# Altium project Longboard_32bit_ext.PrjPCB (part 3 of 6)

## Sheet DC_Power_Regulation.SchDoc: STM32F412 CNC
size B; Author: AM; CompanyName: Expatria Technologies; DrawnBy: A.Marles; Engineer: AM; Organization: Expatria Technolgoies; Address1: PO Box 2084; Address3: Merritt, BC V1K 1B8; Address4: Canada; DocumentNumber: 19; Revision: B9; SheetNumber: 19; SheetTotal: 27
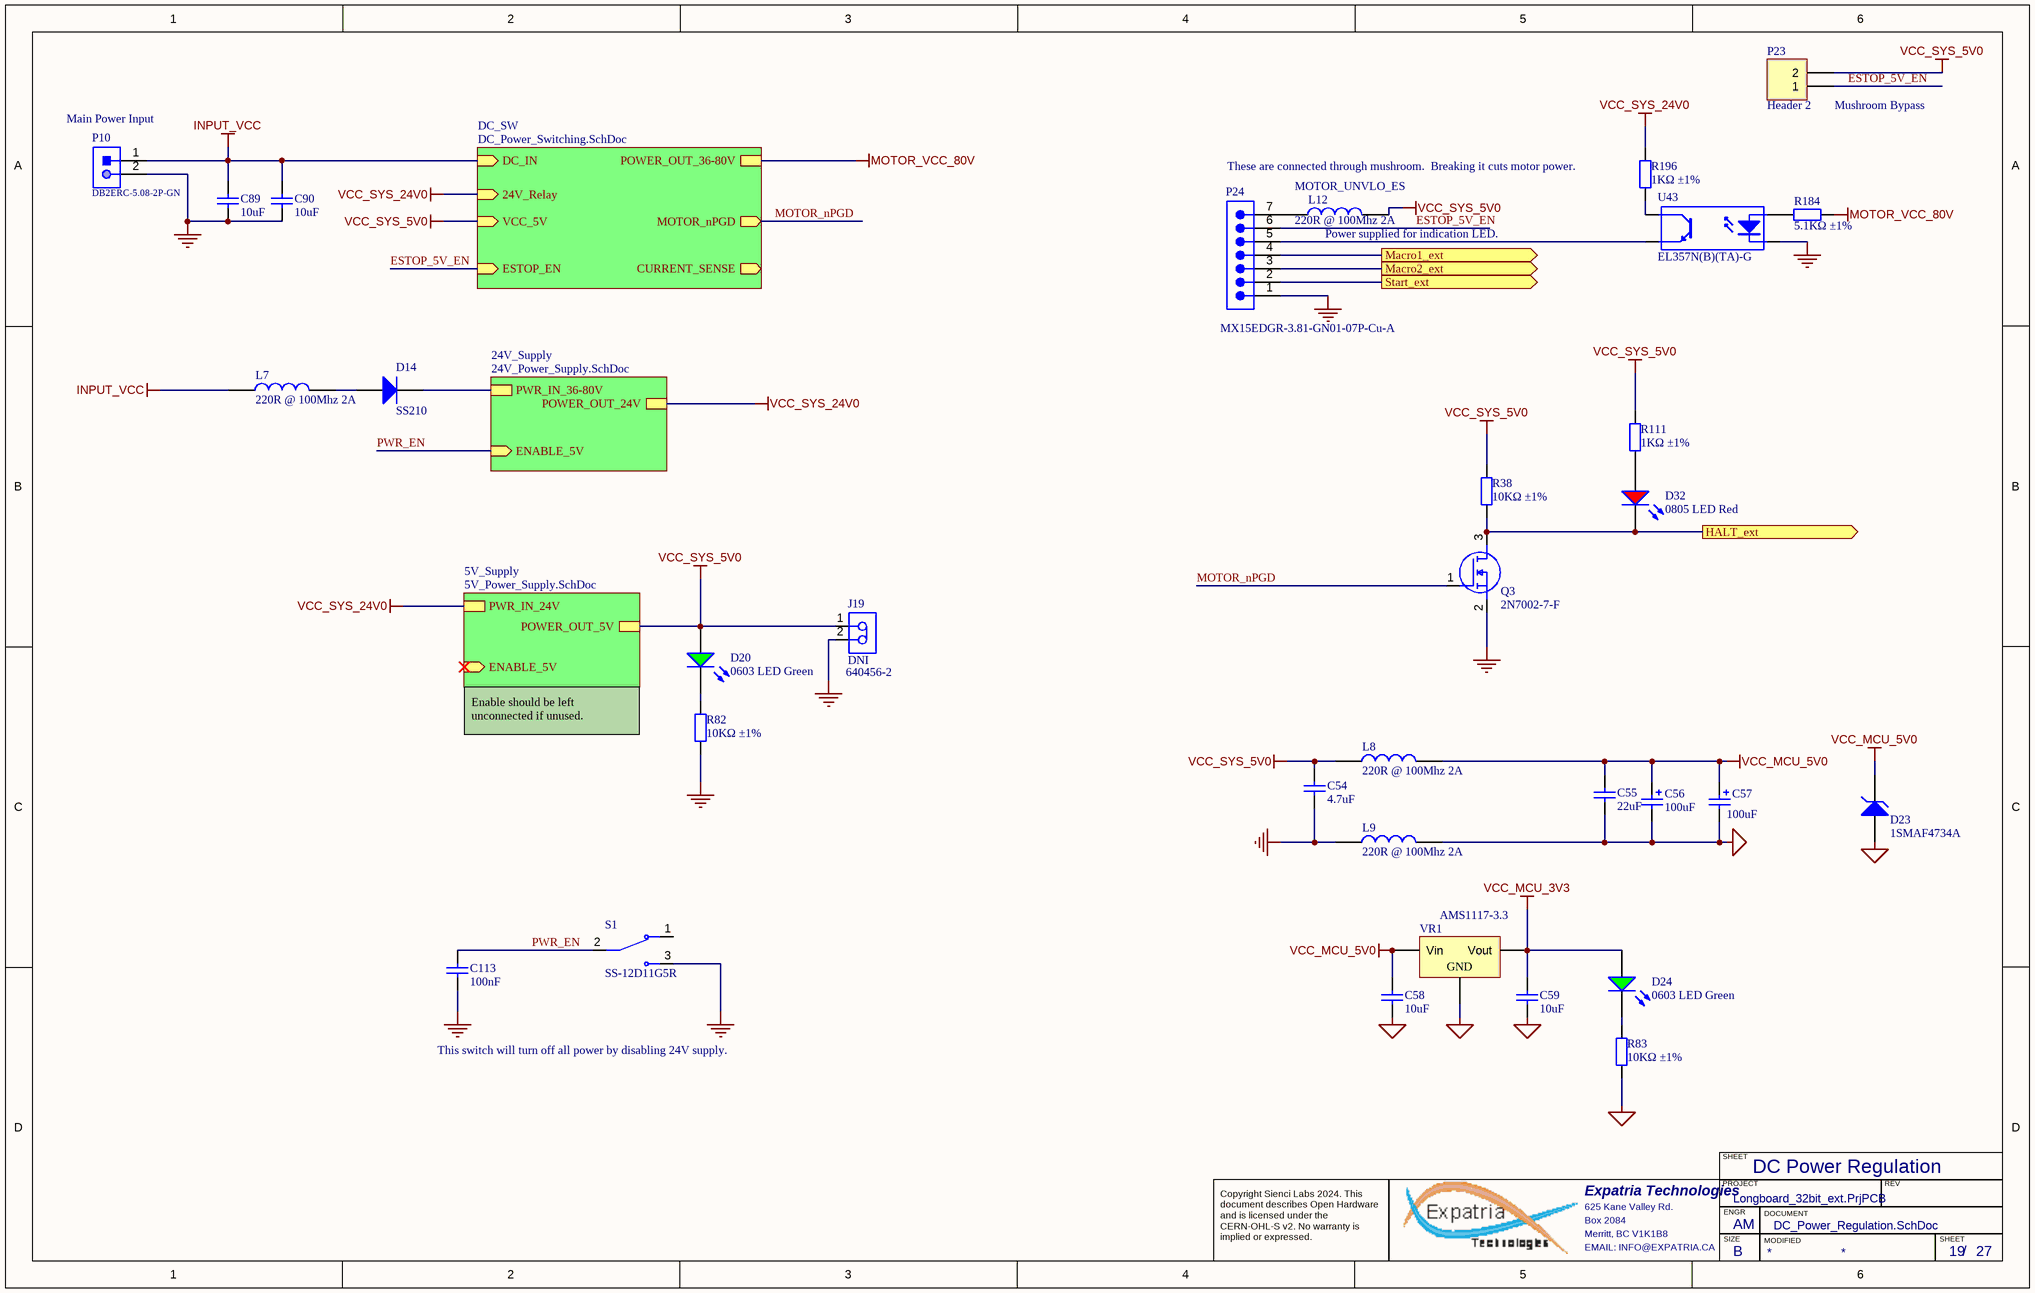
[diagram p12: DC_Power_Regulation.SchDoc]

### Parts
C54  4.7uF  [0603_C]
C55  22uF  [0805_C]
C56  100uF  [CASE-B_3528]
C57  100uF  [WCAP-ASLI_D6.3H7.7]
C58  10uF  [1206_C]
C59  10uF  [1206_C]
C89  10uF  [1206_C]
C90  10uF  [1206_C]
C113  100nF  [0603_C]
D14  SS210  [SMA(DO-214AC)_S1]
D20  0603 LED Green  [0603_LED_S1 - GREEN]
D23  1SMAF4734A  [DIOM5226X240N]
D24  0603 LED Green  [0603_LED_S1 - GREEN]
D32  0805 LED Red  [0805_LED_S1 - RED]
J19  DNI  value 640456-2  [TECO-640456-2_V]
L7  220R @ 100Mhz 2A  [0805_R]
L8  220R @ 100Mhz 2A  [0805_R]
L9  220R @ 100Mhz 2A  [0805_R]
L12  220R @ 100Mhz 2A  [0805_R]
P10  DB2ERC-5.08-2P-GN  [CONN-TH_2P-P5.08_DB2ERC-5.08-2P]
P23  Header 2  [HDR1X2]
P24  MX15EDGR-3.81-GN01-07P-Cu-A  [691322310007]
Q3  2N7002-7-F  [SOT-23(SOT-23-3)]
R38  10KΩ ±1%  [0603_R]
R82  10KΩ ±1%  [0603_R]
R83  10KΩ ±1%  [0603_R]
R111  1KΩ ±1%  [0603_R]
R184  5.1KΩ ±1%  [0603_R]
R196  1KΩ ±1%  [0603_R]
S1  SS-12D11G5R  [SW_500SSP1S1M6QEA]
U43  EL357N(B)(TA)-G  [SOP-4_P2.54]
VR1  AMS1117-3.3  [SOT-223]

### Sub-sheets
5V_Supply = 5V_Power_Supply.SchDoc: POWER_OUT_5V, PWR_IN_24V, ENABLE_5V (in)
24V_Supply = 24V_Power_Supply.SchDoc: ENABLE_5V (in), POWER_OUT_24V, PWR_IN_36-80V
DC_SW = DC_Power_Switching.SchDoc: POWER_OUT_36-80V, DC_IN (in), 24V_Relay (in), VCC_5V (in), MOTOR_nPGD (out), ESTOP_EN (in), CURRENT_SENSE (out)

### Ports
HALT_ext (out), Macro1_ext (out), Macro2_ext (out), Start_ext (out)

### Nets
GND: C54.1 C89.1 C90.1 C113.1 J19.2 L9.1 P10.2 P24.1 Q3.2(S) R82.1 S1.3(NO) U43.2(K)
INPUT_VCC: C89.2 C90.2 L7.1 P10.1 ; sheet DC_SW/DC_IN
MCU_GND: C55.1 C56.2 C57.2(N) C58.1 C59.1 D23.1(A) L9.2 R83.1 VR1.1(GND)
MOTOR_VCC_80V: R184.2 ; sheet DC_SW/POWER_OUT_36-80V
VCC_MCU_3V3: C59.2 D24.A VR1.2(Vout)
VCC_MCU_5V0: C55.2 C56.1 C57.1(P) C58.2 D23.2(K) L8.2 VR1.3(Vin)
VCC_SYS_5V0: C54.2 D20.A J19.1 L8.1 L12.2 P23.2 R38.2 R111.2 ; sheet 5V_Supply/POWER_OUT_5V, sheet DC_SW/VCC_5V
VCC_SYS_24V0: R196.2 ; sheet 5V_Supply/PWR_IN_24V, sheet 24V_Supply/POWER_OUT_24V, sheet DC_SW/24V_Relay
ESTOP_5V_EN: P23.1 P24.6 ; sheet DC_SW/ESTOP_EN
HALT_ext: D32.K Q3.3(D) R38.1 ; port HALT_ext
Macro1_ext: P24.4 ; port Macro1_ext
Macro2_ext: P24.3 ; port Macro2_ext
MOTOR_nPGD: Q3.1(G) ; sheet DC_SW/MOTOR_nPGD
PWR_EN: C113.2 S1.2(COM) ; sheet 24V_Supply/ENABLE_5V
PWR_IN_36-80V: D14.2(K) ; sheet 24V_Supply/PWR_IN_36-80V
Start_ext: P24.2 ; port Start_ext
NetD14_1: D14.1(A) L7.2
NetD20_K: D20.K R82.2
NetD24_K: D24.K R83.2
NetD32_A: D32.A R111.1
NetL12_1: L12.1 P24.7
NetP24_5: P24.5 U43.3(E)
NetR184_1: R184.1 U43.1(A)
NetR196_1: R196.1 U43.4(C)

Not connected (* = marked no-connect by the designer): S1 1(NC)

### Notes on the sheet
- (near P10) Main Power Input
- (near P23) Mushroom Bypass
- (near R196) These are connected through mushroom.  Breaking it cuts motor power.
- (near L12) MOTOR_UNVLO_ES
- (near L12) Power supplied for indication LED.
- Enable should be left unconnected if unused.
- This switch will turn off all power by disabling 24V supply.
- DC Power Regulation
- SHEET
- Expatria Technologies
- 625 Kane Valley Rd.
- Box 2084
- Merritt, BC V1K1B8
- PROJECT
- SIZE
- ENGR
- MODIFIED
- DOCUMENT
- REV
- Copyright Sienci Labs 2024. This document describes Open Hardware and is licensed under the CERN-OHL-S v2. No warranty is implied or expressed.
- EMAIL: INFO@EXPATRIA.CA
- B
- /

### Library data of the parts
C54 = 0603 4.7uF (475) 10% 16V: 16V 4.7uF X5R ±10% 0603 Multilayer Ceramic Capacitors MLCC - SMD/SMT ROHS; Manufacturer: Samsung Electro-Mechanics; Manufacturer Part Number: CL10A475KO8NNNC; ComponentLink1Description: Supplier link; ComponentLink1URL: http://www.szlcsc.com/product/details_20375.html; Package: 0603; Supplier: LC; SuppliersPartNumber: C19666; Capacitance: 4.7uF; Tolerance: 10%; Voltage: 16V
C55 = 0805 22uF (226) 20% 25V: 25V 22uF X5R ±20% 0805 Multilayer Ceramic Capacitors MLCC - SMD/SMT ROHS; Manufacturer: Samsung Electro-Mechanics; Manufacturer Part Number: CL21A226MAQNNNE; ComponentLink1Description: Supplier link; ComponentLink1URL: http://www.szlcsc.com/product/details_46786.html; Package: 0805; Supplier: LC; SuppliersPartNumber: C45783; Capacitance: 22uF; Tolerance: 20%; Voltage: 25V
C56 = 3528 100uF (107) 10% 6.3V: Tantalum capacitor; Manufacturer: AVX; Manufacturer Part Number: TAJB107K006RNJ; Tolerance: 10%; Voltage: 6.3V; ComponentLink1Description: Supplier link; ComponentLink1URL: http://www.szlcsc.com/product/details_16815.html; Package: 3528; Supplier: LCSC; SuppliersPartNumber: C16133; Capacitance: 100uF
C57 = 865080445010: -45℃~+105℃ 2000hrs@105℃ 100uF 7.7mm 35V 6.3mm ±20% SMD,6.3x7.7mm Aluminum Electrolytic Capacitors - SMD ROHS; Manufacturer: Capxon International Elec; Manufacturer Part Number: HV101M035E077ETR; SuppliersPartNumber: C59934; Value: 100uF; Supplier: LCSC
C58 C59 C89 C90 = 1206 10uF (106) 10% 50V: 50V 10uF X5R ±10% 1206 Multilayer Ceramic Capacitors MLCC - SMD/SMT ROHS; Manufacturer: Samsung Electro-Mechanics; Manufacturer Part Number: CL31A106KBHNNNE; Package: 1206; Supplier: LC; SuppliersPartNumber: C13585; Capacitance: 10uF; Tolerance: 10%; Voltage: 50V
C113 = 0603 100nF (104) 10% 50V: 50V 100nF X7R ±10% 0603 Multilayer Ceramic Capacitors MLCC - SMD/SMT ROHS; Manufacturer: YAGEO; Manufacturer Part Number: CC0603KRX7R9BB104; ComponentLink1Description: Supplier link; ComponentLink1URL: http://www.szlcsc.com/product/details_15331.html; Package: 0603; Supplier: LC; SuppliersPartNumber: C14663; Capacitance: 100nF; Tolerance: 10%; Voltage: 50V
D14 = SMA(DO-214AC) SS210: 100V 2A 850mV @ 2A SMA(DO-214AC) Schottky Barrier Diodes (SBD) ROHS; Manufacturer: MDD(Microdiode Electronics); ComponentLink1Description: 供应商链接; ComponentLink1URL: http://www.szlcsc.com/product/details_15669.html; Package: SMA(DO-214AC); Supplier: LC; SuppliersPartNumber: C14996; Manufacturer Part Number: SS210
D20 D24 = MHT192UGCT: 20mA -40℃~+85℃ 515nm~530nm Emerald 120° 60mW 0603 Light Emitting Diodes (LED) ROHS; Manufacturer: MEIHUA; Package: 0603; Supplier: LC; SuppliersPartNumber: C389519; Color: Green; Manufacturer Part Number: MHT192UGCT
D23 = BZT52C27: 27V ±5% 1W 500nA @ 20.5V SMA(DO-214AC) Zener Diodes RoHS; Manufacturer: Shandong Jingdao Microelectronics; ComponentLink1Description: 供应商链接; ComponentLink1URL: http://www.szlcsc.com/product/details_8541.html; Package: SMAF; Supplier: LCSC; SuppliersPartNumber: C169539; Manufacturer Part Number: 1SMAF4734A
D32 = 0805 LED Red: Red 0805 Light Emitting Diodes (LED) ROHS; Manufacturer: Foshan NationStar Optoelectronics; Manufacturer Part Number: NCD0805R1; Package: 0805; Supplier: LC; SuppliersPartNumber: C84256; Color: Red
J19 = CMP-2000-05417-1: Male Header, Pitch 2.54 mm, 1 x 2 Position, Height 10.49 mm, Tail Length 3.556 mm, -55 to 105 degC, RoHS, Bulk; Manufacturer: TE Connectivity; Standards: RoHSCompliant,ELVCompliant,UL94V-0; Material, Housing: Polyester; Agency Approvals: CSA,UL; Brand/Series: MTA-100Series; Contact Centerline Spacing: 0.100 / in.; Material, Contact: CopperAlloy; Current, Rating: 5 / A; Color, Housing: White; Contact Termination Area Plating: Tin; Special Features: Pinstrip; Number of Positions: 2; Pin Spacing: 0.1 / "; Temperature, Operating: -55to+105 / degC; Angle: Straight; Mount Angle: Vertical; Connector Type: MTA-100; Primary Type: InterconnectSystem; Voltage, Rating: 250 / V; Mounting Hole Size: 0.04 / "; Number of Rows: 1; Termination: Solder; Length, Terminal Post: 0.14 / in.; Manufacturer URL: http://www.te.com/; Color: White; Size, Post: 0.025 / in.; Contact Shape: Square; Mounting Type: PCMount; Datasheet URL: https://datasheet.ciiva.com/11746/0900766b80eb7fdd-11746365.pdf; Type: PCBPlug; Datasheet Version: Rev. W, 06/2004; Number of Contacts: 2; Flammability Rating: UL94V-0; Contact Plating: Tin; Length, Pin: 0.14 / "; Contact Mating Area Plating: Tin; Length, Overall: 0.2 / "; SuppliersPartNumber: C86502
L7-L9 L12 = CBW201209U221T: 150mΩ ±25% 220Ω@100MHz 0805 Ferrite Beads ROHS; Manufacturer: FH (Guangdong Fenghua Advanced Tech); Manufacturer Part Number: CBW201209U221T; Package: 0402; Supplier: LC; SuppliersPartNumber: C139188
P10 = DB2ERC-5.08-2P-GN: 320V 20A 2 Bend -40℃~+105℃ 1 5.08mm 1x2P Green Board Edge/Receptacle-Close Push-Pull,P=5.08mm Pluggable System Terminal Block ROHS; Manufacturer: Dibo; Supplier 1: LCSC; Supplier Part Number 1: C395737; Manufacturer Part Number: DB2ERC-5.08-2P-GN; RoHS: Yes; Category: Terminals; SuppliersPartNumber: C395737
P23 = Header 2: Straight Square Pins 2 2.54mm Black Brass 1x2P Plugin,P=2.54mm Pin Headers ROHS; Manufacturer: MOLEX; Manufacturer Part Number: 22284020; Publisher: Altium Limited; LatestRevisionDate: 17-Jul-2002; LatestRevisionNote: Re-released for DXP Platform.; SuppliersPartNumber: C234182; Supplier 1: LCSC; Supplier Part Number 1: C234182
P24 = MX15EDGR-3.81-GN01-07P-Cu-A: 300V 8A 7 Bend -40℃~+105℃ 1 3.81mm 1x7P Green Board Edge/Receptacle-Close Push-Pull,P=3.81mm Pluggable System Terminal Block ROHS; Manufacturer: MAX; Manufacturer Part Number: MX15EDGR-3.81-GN01-07P-Cu-A; SuppliersPartNumber: C5188162
Q3 = 2N7002-7-F: 60V 115mA 7.5Ω@5V,50mA 370mW N Channel SOT-23 MOSFETs ROHS; Manufacturer: Diodes Inc.; SuppliersPartNumber: C85049; Manufacturer Part Number: 2N7002-7-F; Value: 2N7002-7-F; Datasheet Link: https://datasheet.datasheetarchive.com/originals/distributors/SFDatasheet-0/sf-0003625.pdf; Height: 1.2mm; Manufacturer_Part_Number: 2N7002-7-F; Mouser Part Number: 621-2N7002-F; Mouser Price/Stock: https://www.mouser.co.uk/ProductDetail/Diodes-Incorporated/2N7002-7-F?qs=jMXWnm70%252BC%252BAX%252BMLzUkTZg%3D%3D; Arrow Part Number: 2N7002-7-F; Arrow Price/Stock: https://www.arrow.com/en/products/2n7002-7-f/diodes-incorporated?region=nac
R38 R82 R83 = 0603 10K (1002) 1%: Chip resistor; Manufacturer: Uniroyal Elec; Manufacturer Part Number: 0603WAF1002T5E; Power: 1/10W; ComponentLink1Description: Supplier link; ComponentLink1URL: http://www.szlcsc.com/product/details_26547.html; Package: 0603; Supplier: LC; SuppliersPartNumber: C25804; Resistance: 10KΩ; Tolerance: 1%
R111 R196 = 0603 1K (1001) 1%: Chip resistor; Manufacturer: Uniroyal Elec; Manufacturer Part Number: 0603WAF1001T5E; Power: 1/10W; ComponentLink1Description: Supplier link; ComponentLink1URL: http://www.szlcsc.com/product/details_21904.html; Package: 0603; Supplier: LC; SuppliersPartNumber: C21190; Resistance: 1KΩ; Tolerance: 1%
R184 = 0603 5.1K (5101) 1%: Chip resistor; Manufacturer: Uniroyal Elec; Manufacturer Part Number: 0603WAF5101T5E; Power: 1/10W; ComponentLink1Description: Supplier link; ComponentLink1URL: http://www.szlcsc.com/product/details_23913.html; Package: 0603; Supplier: LC; SuppliersPartNumber: C23186; Resistance: 5.1KΩ; Tolerance: 1%
S1 = SS-12D11G5R: Shrouded 5A SPDT 125V 125V 5A 10000次 Black Plugin Slide Switches ROHS; Manufacturer: XKB Connectivity; SuppliersPartNumber: C388633; Manufacturer Part Number: SS-12D11G5R
U43 = EL357N(B)(TA)-G_[C6649]: as U4-U8 on sheet Spindle_Control; Package: SOP-4_P2.54; Supplier: LC; SuppliersPartNumber: C6649; Manufacturer: Everlight; Manufacturer Part Number: EL357N(B)(TA)-G
VR1 = SOT-223 AMS1117-3.3: Vout=3.3V 1A 72dB@(120Hz) (LDO); Manufacturer 1: AMS; ComponentLink1Description: 供应商链接; ComponentLink1URL: http://www.szlcsc.com/product/details_6652.html; Package: SOT-223; Supplier: LCSC; SuppliersPartNumber: C6186; Manufacturer Part Number 1: AMS1117-3.3; Manufacturer: AMS; Manufacturer Part Number: AMS1117-3.3

## Sheet 5V_Power_Supply.SchDoc: STM32F412 CNC
size B; Author: AM; CompanyName: Expatria Technologies; DrawnBy: A.Marles; Engineer: AM; Organization: Expatria Technolgoies; Address1: PO Box 2084; Address3: Merritt, BC V1K 1B8; Address4: Canada; DocumentNumber: 21; Revision: B9; SheetNumber: 20; SheetTotal: 27
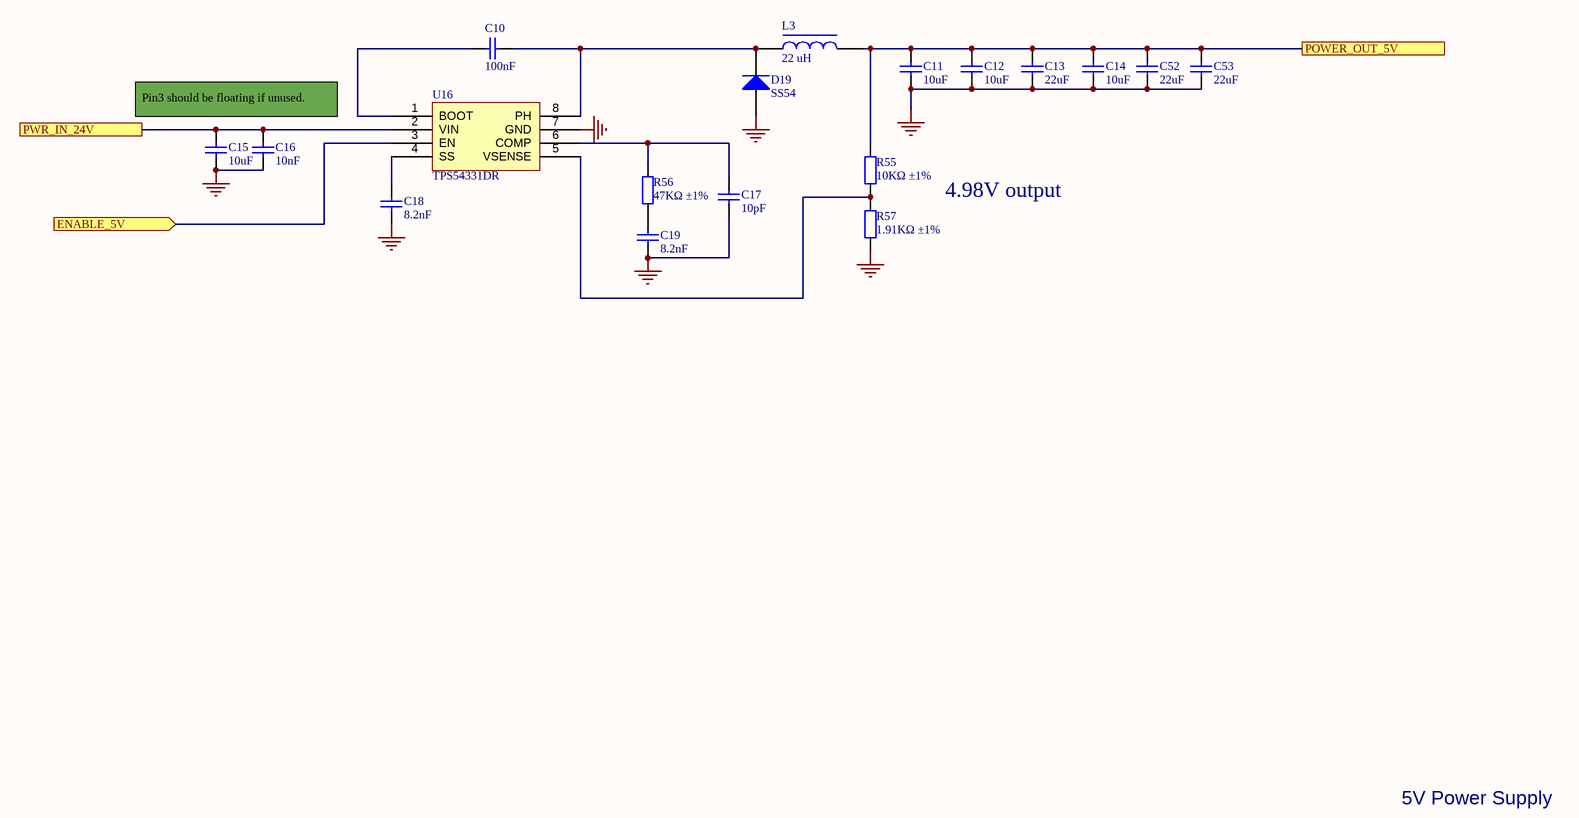
[diagram p13: 5V_Power_Supply.SchDoc]

### Parts
C10  100nF  [0603_C]
C11  10uF  [1206_C]
C12  10uF  [1206_C]
C13  22uF  [0805_C]
C14  10uF  [1206_C]
C15  10uF  [1206_C]
C16  10nF  [0603_C]
C17  10pF  [0603_C]
C18  8.2nF  [0603_C]
C19  8.2nF  [0603_C]
C52  22uF  [0805_C]
C53  22uF  [0805_C]
D19  SS54  [SMA(DO-214AC)_S1]
L3  22 uH  [INDPM7366X300N]
R55  10KΩ ±1%  [0603_R]
R56  47KΩ ±1%  [0603_R]
R57  1.91KΩ ±1%  [0603_R]
U16  TPS54331DR  [SOIC-8_150mil]

### Ports
ENABLE_5V (in), POWER_OUT_5V, PWR_IN_24V

### Nets
GND: C11.1 C12.1 C13.1 C14.1 C15.1 C16.1 C17.1 C18.1 C19.1 C52.1 C53.1 D19.1(A) R57.1 U16.7(GND)
VCC_SYS_5V0: C11.2 C12.2 C13.2 C14.2 C52.2 C53.2 L3.2 R55.2 ; port POWER_OUT_5V
VCC_SYS_24V0: C15.2 C16.2 U16.2(VIN) ; port PWR_IN_24V
ENABLE_5V: U16.3(EN) ; port ENABLE_5V
NetC10_1: C10.1 U16.1(BOOT)
NetC10_2: C10.2 D19.2(K) L3.1 U16.8(PH)
NetC17_2: C17.2 R56.2 U16.6(COMP)
NetC18_2: C18.2 U16.4(SS)
NetC19_2: C19.2 R56.1
NetR55_1: R55.1 R57.2 U16.5(VSENSE)

### Notes on the sheet
- Pin3 should be floating if unused.
- 4.98V output
- 5V Power Supply
- SHEET
- Expatria Technologies
- 625 Kane Valley Rd.
- Box 2084
- Merritt, BC V1K1B8
- PROJECT
- SIZE
- ENGR
- MODIFIED
- DOCUMENT
- REV
- Copyright Sienci Labs 2024. This document describes Open Hardware and is licensed under the CERN-OHL-S v2. No warranty is implied or expressed.
- EMAIL: INFO@EXPATRIA.CA
- B
- /

### Library data of the parts
C10 = 0603 100nF (104) 10% 50V: as C113 on sheet DC_Power_Regulation; Package: 0603; Supplier: LC; SuppliersPartNumber: C14663; Capacitance: 100nF; Tolerance: 10%; Voltage: 50V; ComponentLink1Description: Supplier link; ComponentLink1URL: http://www.szlcsc.com/product/details_15331.html
C11 C12 C14 C15 = 1206 10uF (106) 10% 50V: as C58 on sheet DC_Power_Regulation; Package: 1206; Supplier: LC; SuppliersPartNumber: C13585; Capacitance: 10uF; Tolerance: 10%; Voltage: 50V
C13 C52 C53 = 0805 22uF (226) 20% 25V: as C55 on sheet DC_Power_Regulation; Package: 0805; Supplier: LC; SuppliersPartNumber: C45783; Capacitance: 22uF; Tolerance: 20%; Voltage: 25V; ComponentLink1Description: Supplier link; ComponentLink1URL: http://www.szlcsc.com/product/details_46786.html
C16 = 0603 10nF (103) 10% 50V: 50V 10nF X7R ±10% 0603 Multilayer Ceramic Capacitors MLCC - SMD/SMT ROHS; Manufacturer: Guangdong Fenghua Advanced Tech; Manufacturer Part Number: 0603B103K500NT; Package: 0603; Supplier: LC; SuppliersPartNumber: C57112; Capacitance: 10nF; Tolerance: 10%; Voltage: 50V; ComponentLink1Description: Supplier link; ComponentLink1URL: http://www.szlcsc.com/product/details_58143.html
C17 = 0603 10pF (100) 5% 50V: Chip capacitors; Manufacturer: Samsung Electro-Mechanics; Manufacturer Part Number: CL10C100JB8NNNC; Tolerance: 5%; Voltage: 50V; Package: 0603; Supplier: LCSC; SuppliersPartNumber: C1634; Capacitance: 10pF; ComponentLink1Description: Supplier link; ComponentLink1URL: http://www.szlcsc.com/product/details_1986.html
C18 C19 = 0603 8.2nF (822) 10% 50V: 50V 8.2nF X7R ±10% 0603 Multilayer Ceramic Capacitors MLCC - SMD/SMT ROHS; Manufacturer: YAGEO; Manufacturer Part Number 1: CC0603KRX7R9BB822; Package: 0603; Supplier: LC; SuppliersPartNumber: C113812; Capacitance: 8.2nF; Tolerance: 10%; Voltage: 50V; Manufacturer 1: YAGEO; Value: 8.2nF; Manufacturer Part Number: CC0603KRX7R9BB822
D19 = SMA(DO-214AC) SS54: 40V 5A 550mV@5A; Manufacturer 1: MDD; Package: SMA(DO-214AC); Supplier: LCSC; SuppliersPartNumber: C22452; Manufacturer Part Number 1: SS54; Manufacturer: MDD; Manufacturer Part Number: SS54
L3 = 1206 10uH 10%: 3A 22uH ±20% 130mΩ SMD,7.1x6.6x3mm Power Inductors ROHS; Manufacturer: YJYCOIN; Manufacturer Part Number: YSPI0630A-220M; Package: SMD,7.1x6.6x3mm; Supplier: LCSC; SuppliersPartNumber: C497873
R55 = 0603 10K (1002) 1%: as R38 on sheet DC_Power_Regulation; Package: 0603; Supplier: LC; SuppliersPartNumber: C25804; Resistance: 10KΩ; Tolerance: 1%; ComponentLink1Description: Supplier link; ComponentLink1URL: http://www.szlcsc.com/product/details_26547.html
R56 = 0603 47K (4702) 1%: Chip resistor; Manufacturer: Uniroyal Elec; Manufacturer Part Number: 0603WAF4702T5E; Power: 1/10W; Package: 0603; Supplier: LCSC; SuppliersPartNumber: C25819; Resistance: 47KΩ; Tolerance: 1%; ComponentLink1Description: Supplier link; ComponentLink1URL: http://www.szlcsc.com/product/details_26562.html
R57 = 0603 1.91K (2001) 1%: Chip resistor; Manufacturer: TyoHM; Manufacturer Part Number: RMC06031.91K1%N; Power: 1/10W; Package: 0603; Supplier: LC; SuppliersPartNumber: C325662; Resistance: 1.91KΩ; Tolerance: 1%; ComponentLink1Description: Supplier link; ComponentLink1URL: http://www.szlcsc.com/product/details_23702.html
U16 = TPS54331DR_[C9865]: Switching Voltage Regulators 3A 28V In Step Down SWIFT DC/DC Cnvrtr; Manufacturer: Texas Instruments; Package: SOIC-8_150mil; Supplier: LCSC; SuppliersPartNumber: C9865; Manufacturer Part Number: TPS54331DR

## Sheet 24V_Power_Supply.SchDoc: STM32F412 CNC
size B; Author: AM; CompanyName: Expatria Technologies; DrawnBy: A.Marles; Engineer: AM; Organization: Expatria Technolgoies; Address1: PO Box 2084; Address3: Merritt, BC V1K 1B8; Address4: Canada; DocumentNumber: 20; Revision: B9; SheetNumber: 21; SheetTotal: 27
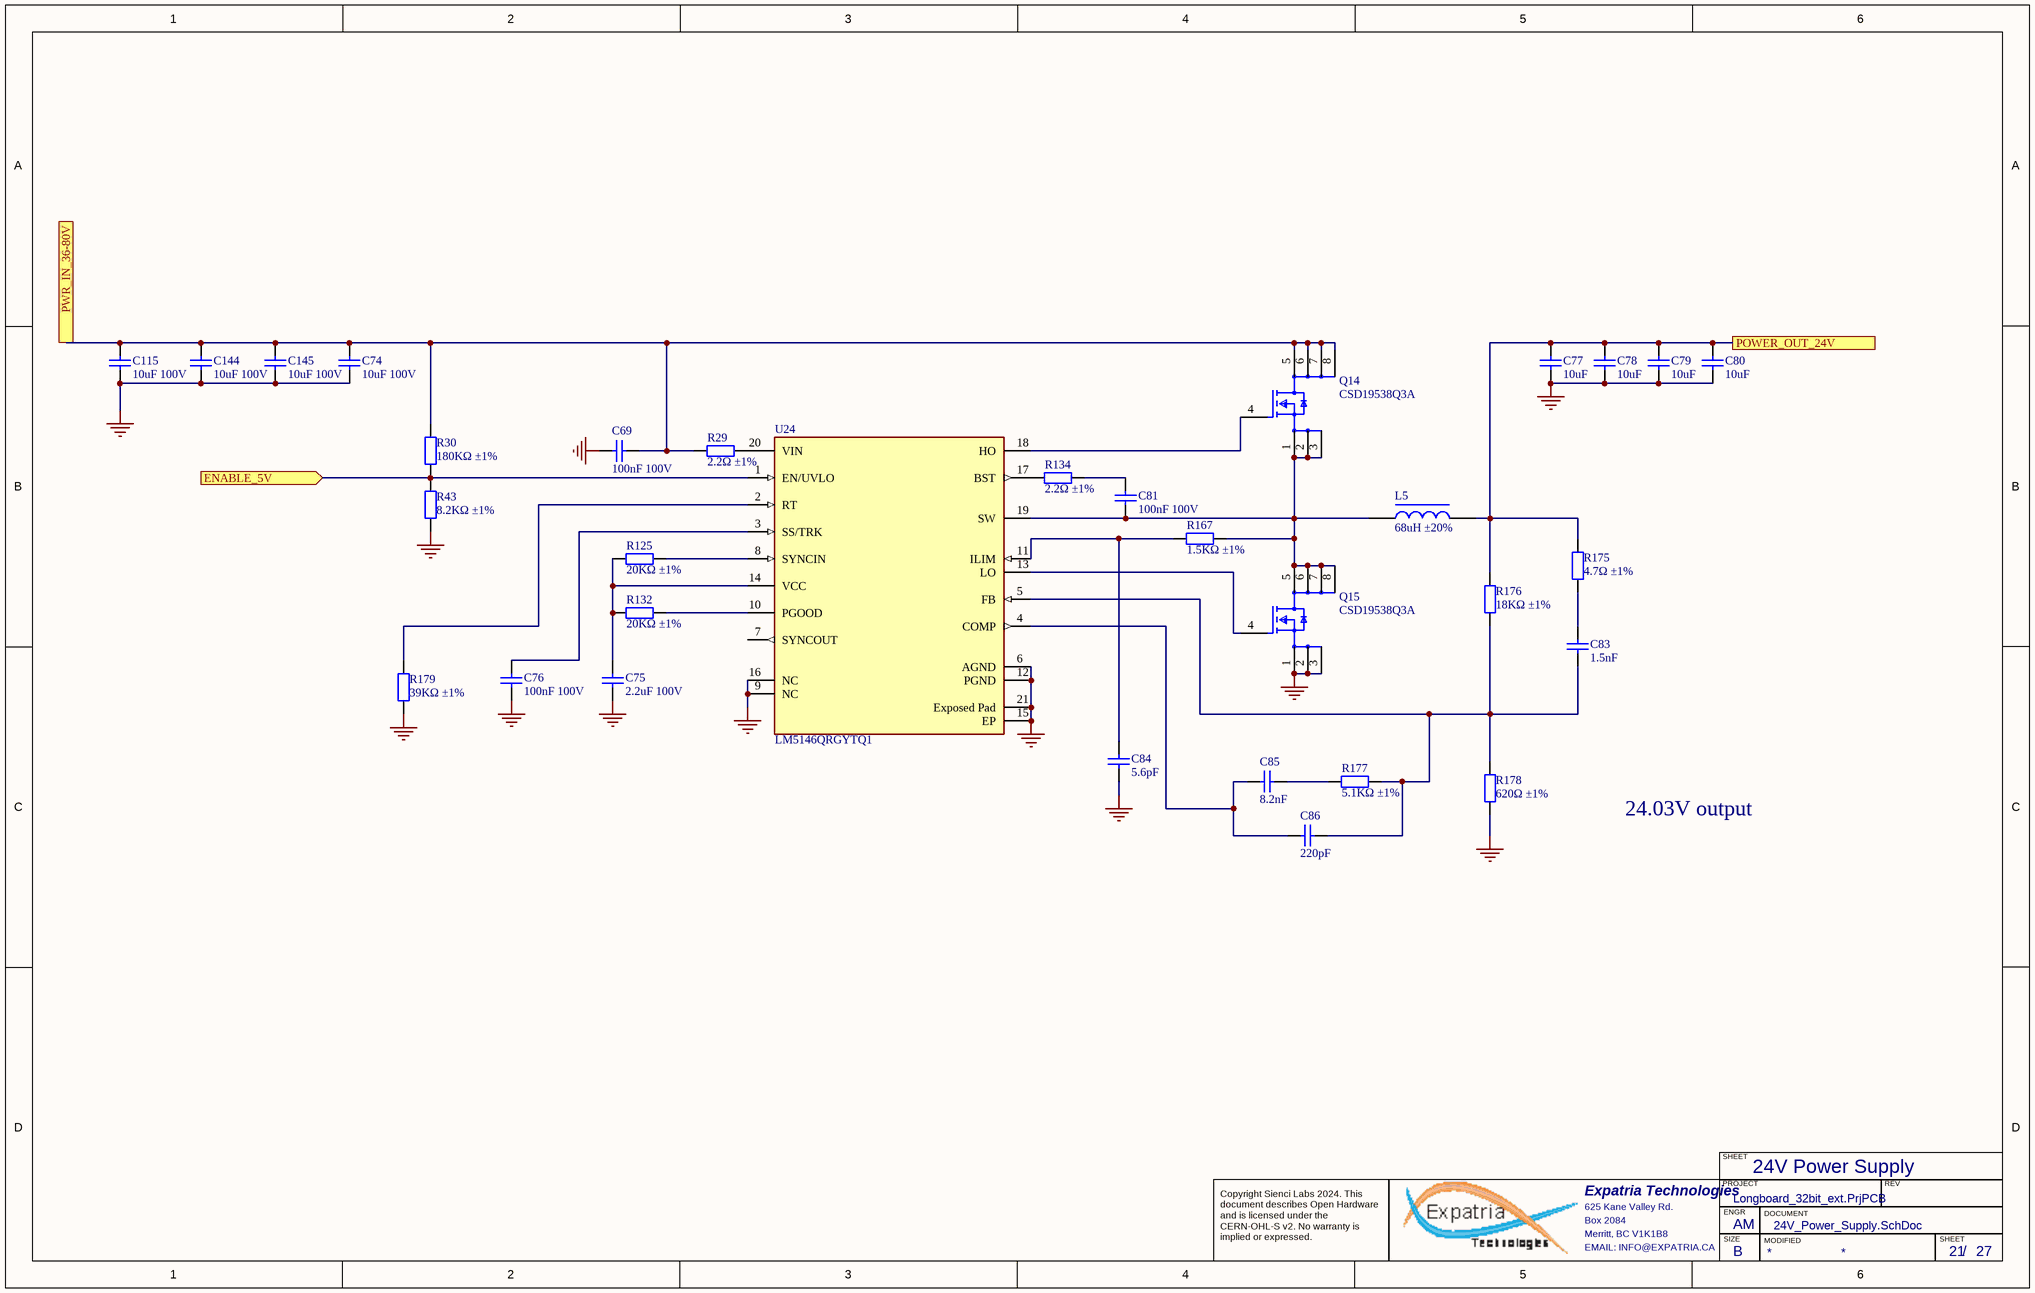
[diagram p14: 24V_Power_Supply.SchDoc]

### Parts
C69  100nF 100V  [0805_C]
C74  10uF 100V  [1210_C]
C75  2.2uF 100V  [1206_C]
C76  100nF 100V  [0805_C]
C77  10uF  [1206_C]
C78  10uF  [1206_C]
C79  10uF  [1206_C]
C80  10uF  [1206_C]
C81  100nF 100V  [0805_C]
C83  1.5nF  [0603_C]
C84  5.6pF  [0603_C]
C85  8.2nF  [0603_C]
C86  220pF  [0603_C]
C115  10uF 100V  [1210_C]
C144  10uF 100V  [1210_C]
C145  10uF 100V  [1210_C]
L5  68uH ±20%  [INDP126126X68N]
Q14  CSD19538Q3A  [FP-DNH0008A-MFG]
Q15  CSD19538Q3A  [FP-DNH0008A-MFG]
R29  2.2Ω ±1%  [0603_R]
R30  180KΩ ±1%  [0603_R]
R43  8.2KΩ ±1%  [0603_R]
R125  20KΩ ±1%  [0603_R]
R132  20KΩ ±1%  [0603_R]
R134  2.2Ω ±1%  [0603_R]
R167  1.5KΩ ±1%  [0603_R]
R175  4.7Ω ±1%  [0603_R]
R176  18KΩ ±1%  [0603_R]
R177  5.1KΩ ±1%  [0603_R]
R178  620Ω ±1%  [0603_R]
R179  39KΩ ±1%  [0603_R]
U24  LM5146QRGYTQ1  [FP-RGY0020B-MFG]

### Ports
ENABLE_5V (in), POWER_OUT_24V, PWR_IN_36-80V

### Nets
GND: C69.1 C74.1 C75.1 C76.1 C77.1 C78.1 C79.1 C80.1 C84.1 C115.1 C144.1 C145.1 Q15.1(S) Q15.2(S) Q15.3(S) R43.1 R178.1 R179.1 U24.6(AGND) U24.9(NC) U24.12(PGND) U24.15(EP) U24.16(NC) U24.21(Exposed_Pad)
VCC_SYS_24V0: C77.2 C78.2 C79.2 C80.2 L5.2 R175.1 R176.2 ; port POWER_OUT_24V
PWR_EN: R30.1 R43.2 U24.1(EN/UVLO) ; port ENABLE_5V
PWR_IN_36-80V: C69.2 C74.2 C115.2 C144.2 C145.2 Q14.5(D) Q14.6(D) Q14.7(D) Q14.8(D) R29.1 R30.2 ; port PWR_IN_36-80V
NetC75_2: C75.2 R125.1 R132.1 U24.14(VCC)
NetC76_2: C76.2 U24.3(SS/TRK)
NetC81_1: C81.1 L5.1 Q14.1(S) Q14.2(S) Q14.3(S) Q15.5(D) Q15.6(D) Q15.7(D) Q15.8(D) R167.2 U24.19(SW)
NetC81_2: C81.2 R134.2
NetC83_1: C83.1 C86.2 R176.1 R177.2 R178.2 U24.5(FB)
NetC83_2: C83.2 R175.2
NetC84_2: C84.2 R167.1 U24.11(ILIM)
NetC85_1: C85.1 C86.1 U24.4(COMP)
NetC85_2: C85.2 R177.1
NetQ14_4: Q14.4(G) U24.18(HO)
NetQ15_4: Q15.4(G) U24.13(LO)
NetR29_2: R29.2 U24.20(VIN)
NetR125_2: R125.2 U24.8(SYNCIN)
NetR132_2: R132.2 U24.10(PGOOD)
NetR134_1: R134.1 U24.17(BST)
NetR179_2: R179.2 U24.2(RT)

Not connected (* = marked no-connect by the designer): U24 7(SYNCOUT)

### Notes on the sheet
- 24.03V output
- 24V Power Supply
- SHEET
- Expatria Technologies
- 625 Kane Valley Rd.
- Box 2084
- Merritt, BC V1K1B8
- PROJECT
- SIZE
- ENGR
- MODIFIED
- DOCUMENT
- REV
- Copyright Sienci Labs 2024. This document describes Open Hardware and is licensed under the CERN-OHL-S v2. No warranty is implied or expressed.
- EMAIL: INFO@EXPATRIA.CA
- B
- /

### Library data of the parts
C69 C76 C81 = 0805 100nF (683) 10% 100V: Chip capacitors; Manufacturer: Guangdong Fenghua Advanced Tech; Manufacturer Part Number: 0805B104K101NT; Tolerance: 10%; ComponentLink1Description: Supplier link; ComponentLink1URL: http://www.szlcsc.com/product/details_2108.html; Package: 0805; Supplier: LC; SuppliersPartNumber: C89258; Capacitance: 100nF; Voltage: 100V
C74 C115 C144 C145 = 1210 10uF (106) 10% 100V: Chip capacitors; Manufacturer: Murata; Manufacturer Part Number: GRM32EC72A106KE05L; Tolerance: 10%; Package: 1210; Supplier: LC; SuppliersPartNumber: C576517; Capacitance: 10uF; Voltage: 100V
C75 = 1206 2.2uF (225) 10% 50V: Chip capacitors; Manufacturer: Samsung Electro-Mechanics; Manufacturer Part Number: CL31A225KBHNNNE; Tolerance: 10%; ComponentLink1Description: Supplier link; ComponentLink1URL: http://www.szlcsc.com/product/details_13292.html; Package: 1206; Supplier: LC; SuppliersPartNumber: C170101; Capacitance: 2.2uF; Voltage: 100V
C77-C80 = 1206 10uF (106) 10% 50V: as C58 on sheet DC_Power_Regulation; Package: 1206; Supplier: LC; SuppliersPartNumber: C13585; Capacitance: 10uF; Tolerance: 10%; Voltage: 50V
C83 = 0603 1.5nF (152) 10% 50V: Chip capacitors; Manufacturer: Guangdong Fenghua Advanced Tech; Manufacturer Part Number: 0603B152K500NT; Tolerance: 10%; Voltage: 50V; ComponentLink1Description: Supplier link; ComponentLink1URL: http://www.szlcsc.com/product/details_1947.html; Package: 0603; Supplier: LC; SuppliersPartNumber: C1595; Capacitance: 1.5nF
C84 = 0603 4.7pF (4R7) 0.25pF 50V: Chip capacitors; Manufacturer: Murata; Manufacturer Part Number: GQM1875C2E5R6BB12D; Tolerance: 0.25pF; Voltage: 250V; ComponentLink1Description: Supplier link; ComponentLink1URL: http://www.szlcsc.com/product/details_2021.html; Package: 0603; Supplier: LC; SuppliersPartNumber: C2297617; Capacitance: 5.6pF
C85 = 0603 8.2nF (822) 10% 50V: as C18 on sheet 5V_Power_Supply; Package: 0603; Supplier: LC; SuppliersPartNumber: C113812; Capacitance: 8.2nF; Tolerance: 10%; Voltage: 50V; Manufacturer 1: YAGEO; Value: 8.2nF; Manufacturer Part Number: CC0603KRX7R9BB822
C86 = 0603 220pF (221) 10% 50V: Chip capacitors; Manufacturer: Samsung Electro-Mechanics; Manufacturer Part Number: CL10B221KB8NNNC; Tolerance: 10%; Voltage: 50V; ComponentLink1Description: Supplier link; ComponentLink1URL: http://www.szlcsc.com/product/details_1955.html; Package: 0603; Supplier: LC; SuppliersPartNumber: C1603; Capacitance: 220pF
L5 = 12.5x12.5x6.5 68uH 20% 3A: 3A 68uH ±20% 64.8mΩ SMD Inductors (SMD) ROHS; Manufacturer: hanxia; Manufacturer Part Number: HX CYH125-68UH; Package: SMD,12.5x12.5mm; Supplier: LC; SuppliersPartNumber: C7587712; Value: 68uH ±20%
Q14 Q15 = CSD19538Q3A: CSD19538Q3A 100-V, N channel NexFET™ power MOSFET, single SON 3 mm x 3 mm, 61 mOhm 8-VSONP -55 to 150; Manufacturer Lifecycle Status: ACTIVE; NexarPartId: 74208282; Manufacturer: Texas Instruments; Drain to Source Voltage (Vdss): 100V; Number of Channels: 1; Power Dissipation: 2.8W; Continuous Drain Current (ID): 4.9A; Input Capacitance: 454pF; Turn-On Delay Time: 5ns; Rds On Max: 59mΩ; Gate to Source Voltage (Vgs): 20V; Max Junction Temperature (Tj): 150°C; Turn-Off Delay Time: 7ns; Drain to Source Resistance: 49mΩ; Mount: Surface Mount; Min Operating Temperature: -55°C; Lead Free: Lead Free; Width: 3.3mm; Length: 3.3mm; Lifecycle Status: Production; Schedule B: 8541290080, 8541290080; RoHS: Compliant; Max Operating Temperature: 150°C; Height: 900µm; Drain to Source Breakdown Voltage: 100V; Element Configuration: Single; Number of Pins: 8; Thickness: 800µm; Max Power Dissipation: 2.8W; SuppliersPartNumber: C478471; Manufacturer Part Number 1: CSD19538Q3A; Manufacturer Part Number: CSD19538Q3A
R29 R134 = 0603 2.2R (2R20) 1%: Chip resistor; Manufacturer: Uniroyal Elec; Manufacturer Part Number: 0603WAF220KT5E; Power: 1/10W; ComponentLink1Description: Supplier link; ComponentLink1URL: http://www.szlcsc.com/product/details_23666.html; Package: 0603; Supplier: LC; SuppliersPartNumber: C22939; Resistance: 2.2Ω; Tolerance: 1%
R30 = 0603 180K (1803) 1%: Chip resistor; Manufacturer: Uniroyal Elec; Manufacturer Part Number: 0603WAF1803T5E; Power: 1/10W; ComponentLink1Description: Supplier link; ComponentLink1URL: http://www.szlcsc.com/product/details_23554.html; Package: 0603; Supplier: LC; SuppliersPartNumber: C22827; Resistance: 180KΩ; Tolerance: 1%
R43 = 0603 8.2K (8201) 1%: Chip resistor; Manufacturer: Uniroyal Elec; Manufacturer Part Number: 0603WAF8201T5E; Power: 1/10W; ComponentLink1Description: Supplier link; ComponentLink1URL: http://www.szlcsc.com/product/details_26724.html; Package: 0603; Supplier: LC; SuppliersPartNumber: C25981; Resistance: 8.2KΩ; Tolerance: 1%
R125 R132 = 0603 20K (2002) 1%: Chip resistor; Manufacturer: Uniroyal Elec; Manufacturer Part Number: 0603WAF2002T5E; Power: 1/10W; ComponentLink1Description: Supplier link; ComponentLink1URL: http://www.szlcsc.com/product/details_4591.html; Package: 0603; Supplier: LC; SuppliersPartNumber: C4184; Resistance: 20KΩ; Tolerance: 1%
R167 = 0603 1.5K (1501) 1%: Chip resistor; Manufacturer: Uniroyal Elec; Manufacturer Part Number: 0603WAF1501T5E; Power: 1/10W; ComponentLink1Description: Supplier link; ComponentLink1URL: http://www.szlcsc.com/product/details_23570.html; Package: 0603; Supplier: LC; SuppliersPartNumber: C22843; Resistance: 1.5KΩ; Tolerance: 1%
R175 = 0603 4.7R (4R70) 1%: Chip resistor; Manufacturer: Uniroyal Elec; Manufacturer Part Number: 0603WAF470KT5E; Power: 1/10W; ComponentLink1Description: Supplier link; ComponentLink1URL: http://www.szlcsc.com/product/details_23891.html; Package: 0603; Supplier: LC; SuppliersPartNumber: C23164; Resistance: 4.7Ω; Tolerance: 1%
R176 = 0603 18K (1802) 1%: Chip resistor; Manufacturer: Uniroyal Elec; Manufacturer Part Number: 0603WAF1802T5E; Power: 1/10W; ComponentLink1Description: Supplier link; ComponentLink1URL: http://www.szlcsc.com/product/details_26553.html; Package: 0603; Supplier: LC; SuppliersPartNumber: C25810; Resistance: 18KΩ; Tolerance: 1%
R177 = 0603 5.1K (5101) 1%: as R184 on sheet DC_Power_Regulation; ComponentLink1Description: Supplier link; ComponentLink1URL: http://www.szlcsc.com/product/details_23913.html; Package: 0603; Supplier: LC; SuppliersPartNumber: C23186; Resistance: 5.1KΩ; Tolerance: 1%
R178 = 0603 620R (6200) 1%: Chip resistor; Manufacturer: Uniroyal Elec; Manufacturer Part Number: 0603WAF6200T5E; Power: 1/10W; ComponentLink1Description: Supplier link; ComponentLink1URL: http://www.szlcsc.com/product/details_23947.html; Package: 0603; Supplier: LC; SuppliersPartNumber: C23220; Resistance: 620Ω; Tolerance: 1%
R179 = 0603 39K (3902) 1%: Chip resistor; Manufacturer: Uniroyal Elec; Manufacturer Part Number: 0603WAF3902T5E; Power: 1/10W; ComponentLink1Description: Supplier link; ComponentLink1URL: http://www.szlcsc.com/product/details_23880.html; Package: 0603; Supplier: LC; SuppliersPartNumber: C23153; Resistance: 39KΩ; Tolerance: 1%
U24 = LM5146QRGYTQ1: Automotive 100-V synchronous buck DC/DC controller with wide duty-cycle range 20-VQFN -40 to 150; Manufacturer 1: Texas Instruments; RoHS Compliant: Yes; SuppliersPartNumber: C3188679; Manufacturer Part Number 1: LM5146QRGYTQ1; Supplier 1: LCSC; Supplier Part Number 1: C2876733; Manufacturer: Texas Instruments; Manufacturer Part Number: LM5146QRGYTQ1; RoHS: Yes; Category: Voltage Regulators - Switching; Stock 1: 6; Pricing 1: 1=4.6067, 10=4.4193, 30=4.0941, 100=3.8099 (USD); ComponentLink1URL: http://www.ti.com/general/docs/suppproductinfo.tsp?distId=10&amp;gotoUrl=http%3A%2F%2Fwww.ti.com%2Flit%2Fgpn%2Flm5146-q1&src-supplier=Digikey; ComponentLink1Description: http://www.ti.com/general/docs/suppproductinfo.tsp?distId=10&amp;gotoUrl=http%3A%2F%2Fwww.ti.com%2Flit%2Fgpn%2Flm5146-q1&src-supplier=Digikey